# EAGLE board csa_bios_v3.0g (EAGLE 6.4)
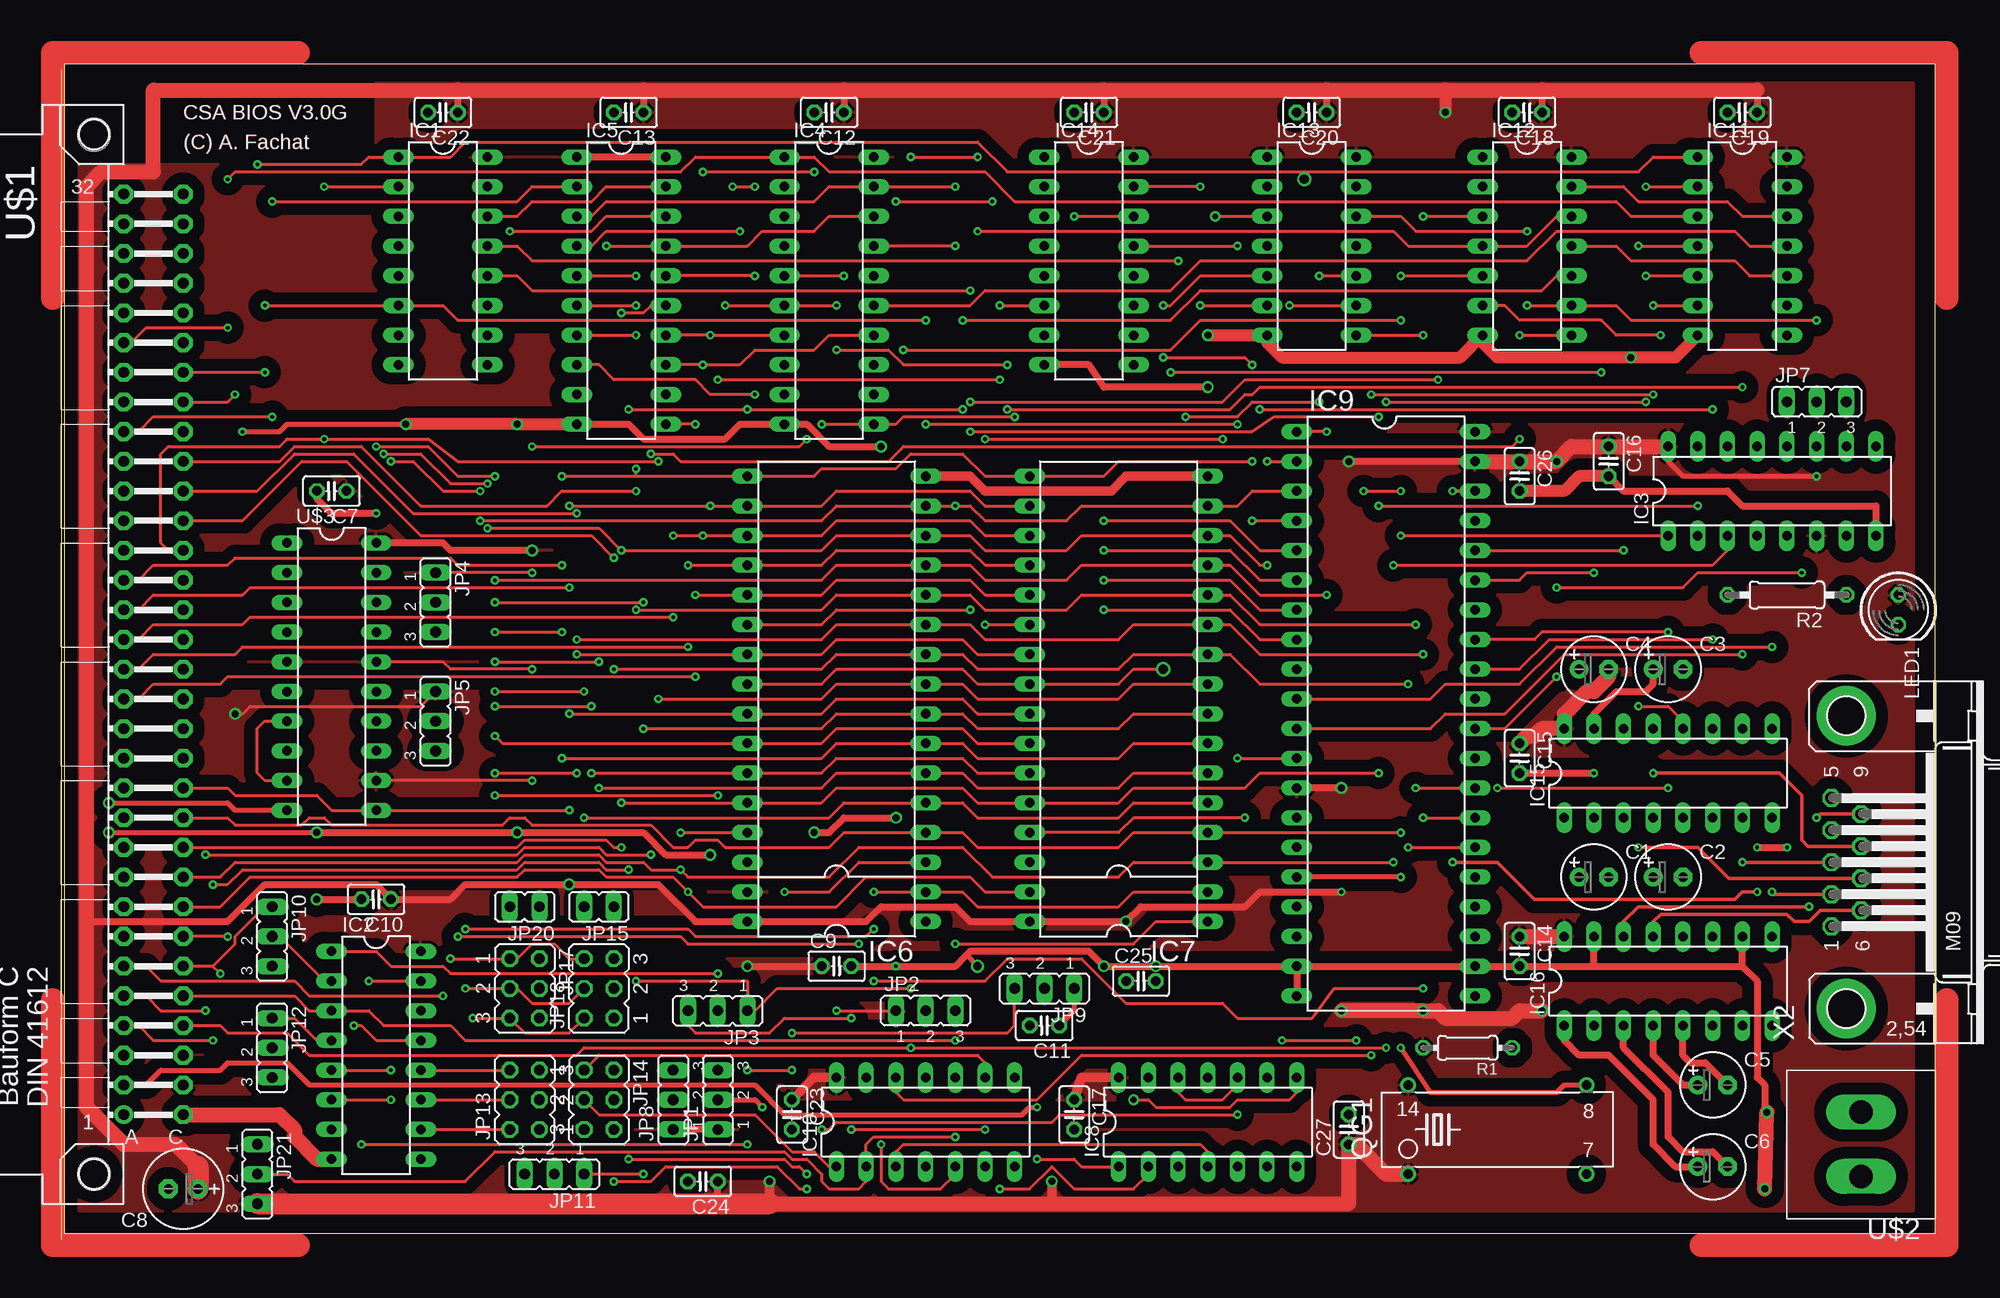
[diagram p2: board, top side]
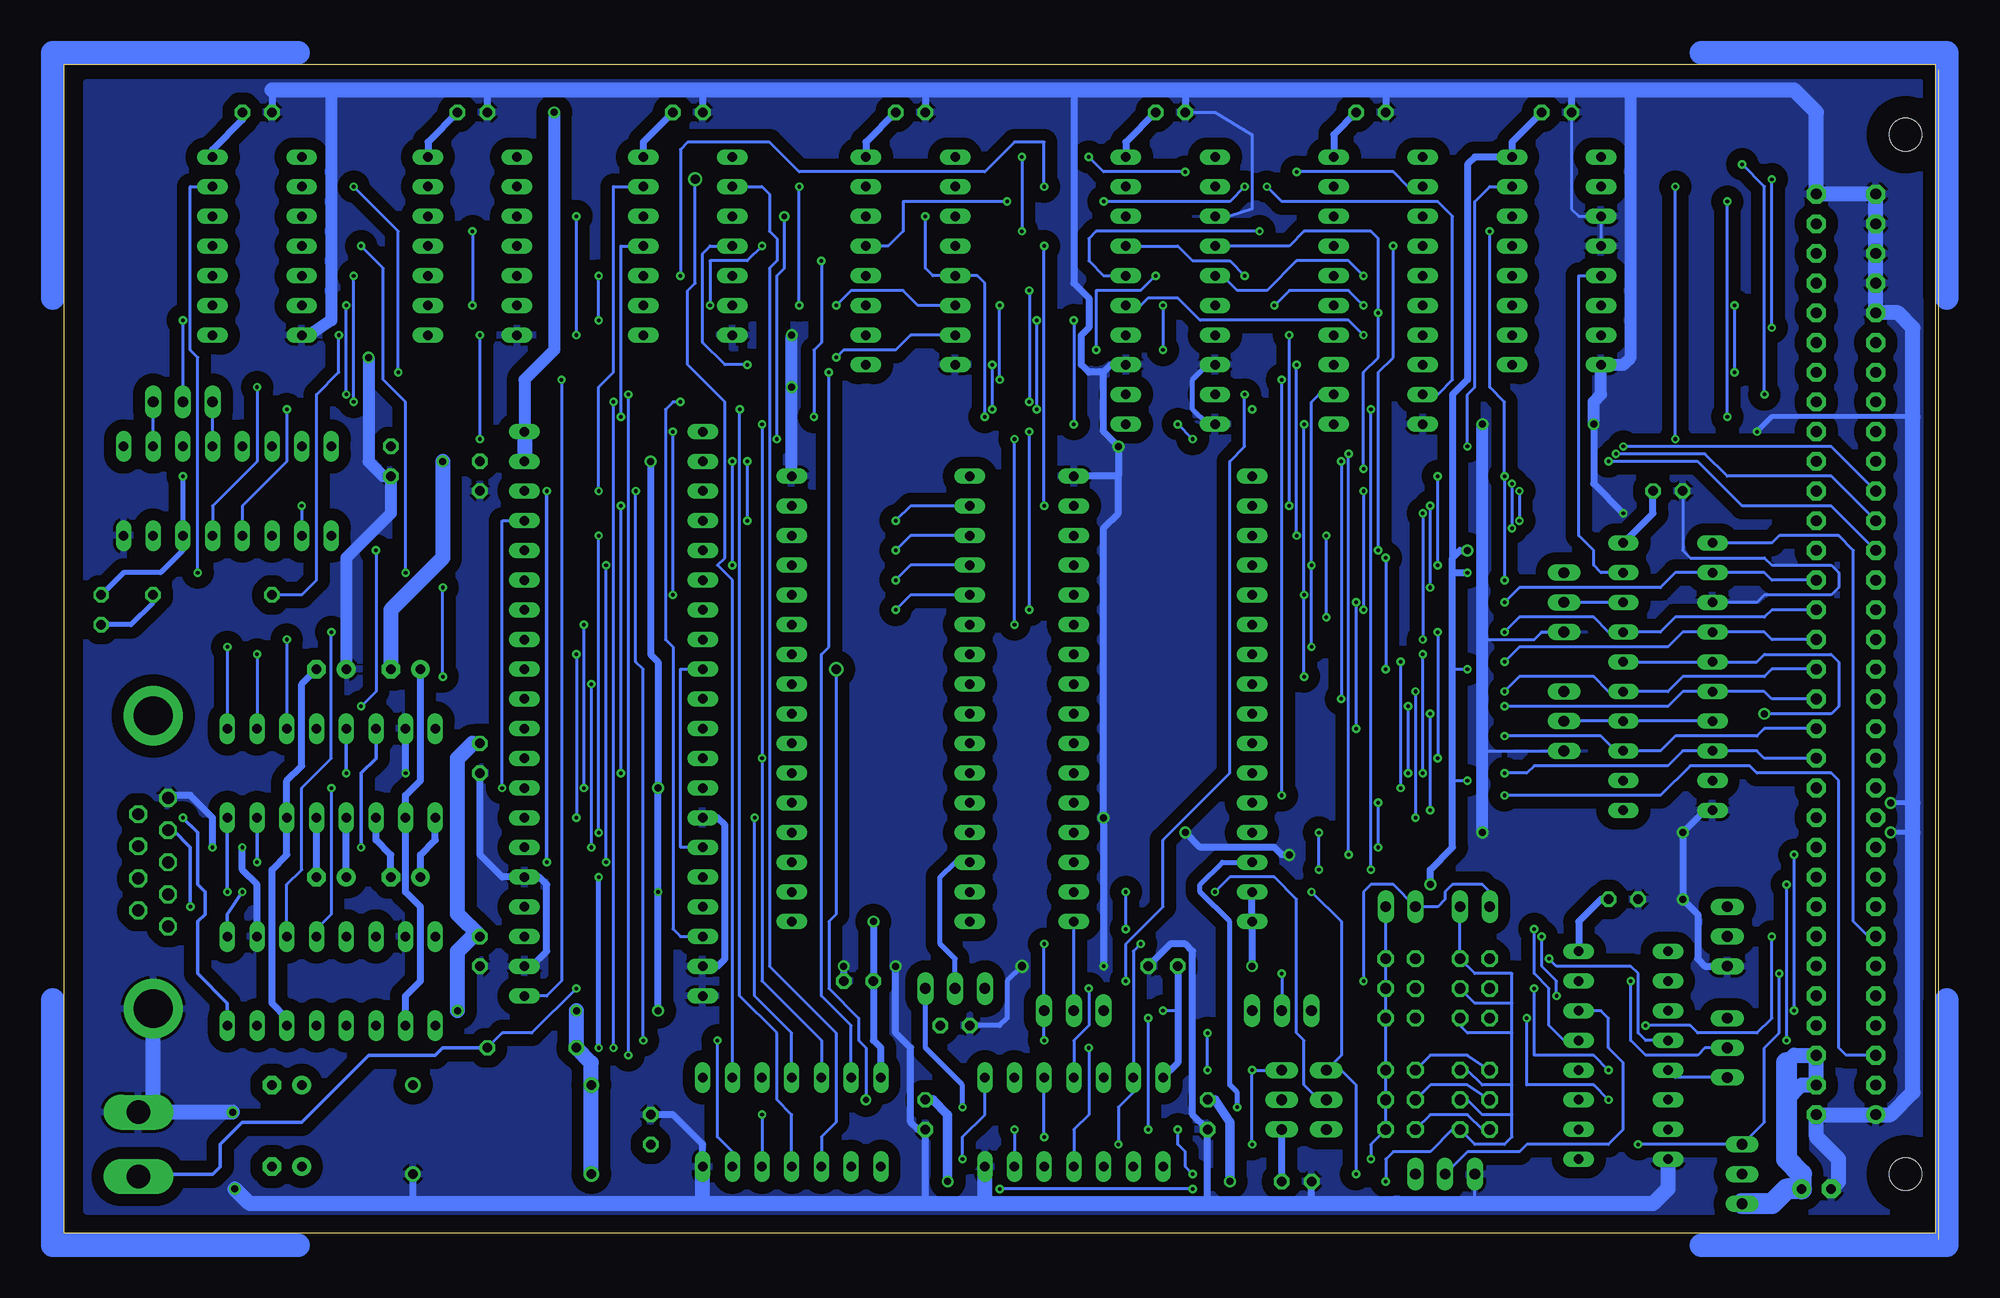
[diagram p3: board, bottom side, seen from below]

Size 160 x 100 mm. Coordinates in mm from the lower left corner, seen from the top.
Outline: 0,0 160,0 160,100 0,100 0,0
Copper layers (1*16): Top 0.035mm / dielectric 1.5mm / Bottom 0.035mm
Design rules "default *": minimum track width 10mil, minimum drill 12mil, track to track 6mil, track to pad 6mil, pad to pad 6mil, via to via 6mil, smd to smd 6mil, copper to edge 40mil, drill to drill 6mil, minimum pad ring 10mil, minimum via ring 8mil, stop-mask expansion 4mil, vias tented up to drill 0mil, thermal gap 10mil

## Footprints (pad centres in the part's own frame; a part is rotated, then mirrored left to right if it is on the bottom)
E2,5-6 = drill 0.813 pad 1.6: + -1.27,0 | drill 0.813 pad 1.6 octagon: - 1.27,0
C025-025X050 = drill 0.813 octagon: 1 -1.27,0; 2 1.27,0
E2,5-7 = drill 0.813 pad 1.6: + -1.27,0 | drill 0.813 pad 1.6 octagon: - 1.27,0
DIL16 = drill 0.813 long: 1 -8.89,-3.81; 2 -6.35,-3.81; 3 -3.81,-3.81; 4 -1.27,-3.81; 5 1.27,-3.81; 6 3.81,-3.81; 7 6.35,-3.81; 8 8.89,-3.81; 9 8.89,3.81; 10 6.35,3.81; 11 3.81,3.81; 12 1.27,3.81; 13 -1.27,3.81; 14 -3.81,3.81; 15 -6.35,3.81; 16 -8.89,3.81
DIL20 = drill 0.813 long: 1 -10.16,-3.81; 2 -7.62,-3.81; 3 -5.08,-3.81; 4 -2.54,-3.81; 5 0,-3.81; 6 2.54,-3.81; 7 5.08,-3.81; 8 7.62,-3.81; 9 10.16,-3.81; 10 12.7,-3.81; 11 12.7,3.81; 12 10.16,3.81; 13 7.62,3.81; 14 5.08,3.81; 15 2.54,3.81; 16 0,3.81; 17 -2.54,3.81; 18 -5.08,3.81; 19 -7.62,3.81; 20 -10.16,3.81
DIL20' = drill 0.813 long: 1 -11.43,-3.81; 2 -8.89,-3.81; 3 -6.35,-3.81; 4 -3.81,-3.81; 5 -1.27,-3.81; 6 1.27,-3.81; 7 3.81,-3.81; 8 6.35,-3.81; 9 8.89,-3.81; 10 11.43,-3.81; 11 11.43,3.81; 12 8.89,3.81; 13 6.35,3.81; 14 3.81,3.81; 15 1.27,3.81; 16 -1.27,3.81; 17 -3.81,3.81; 18 -6.35,3.81; 19 -8.89,3.81; 20 -11.43,3.81
DIL32OPT28 = drill 0.813 long: 1 -19.05,-7.62; 2 -16.51,-7.62; 3 -13.97,-7.62; 4 -11.43,-7.62; 5 -8.89,-7.62; 6 -6.35,-7.62; 7 -3.81,-7.62; 8 -1.27,-7.62; 9 1.27,-7.62; 10 3.81,-7.62; 11 6.35,-7.62; 12 8.89,-7.62; 13 11.43,-7.62; 14 13.97,-7.62; 15 16.51,-7.62; 16 19.05,-7.62; 17 19.05,7.62; 18 16.51,7.62; 19 13.97,7.62; 20 11.43,7.62; 21 8.89,7.62; 22 6.35,7.62; 23 3.81,7.62; 24 1.27,7.62; 25 -1.27,7.62; 26 -3.81,7.62; 27 -6.35,7.62; 28 -8.89,7.62; 29 -11.43,7.62; 30 -13.97,7.62; 31 -16.51,7.62; 32 -19.05,7.62
DIL14 = drill 0.813 long: 1 -7.62,-3.81; 2 -5.08,-3.81; 3 -2.54,-3.81; 4 0,-3.81; 5 2.54,-3.81; 6 5.08,-3.81; 7 7.62,-3.81; 8 7.62,3.81; 9 5.08,3.81; 10 2.54,3.81; 11 0,3.81; 12 -2.54,3.81; 13 -5.08,3.81; 14 -7.62,3.81
DIL40 = drill 0.813 long: 1 -16.51,-7.62; 2 -13.97,-7.62; 3 -11.43,-7.62; 4 -8.89,-7.62; 5 -6.35,-7.62; 6 -3.81,-7.62; 7 -1.27,-7.62; 8 1.27,-7.62; 9 3.81,-7.62; 10 6.35,-7.62; 11 8.89,-7.62; 12 11.43,-7.62; 13 13.97,-7.62; 14 16.51,-7.62; 15 19.05,-7.62; 16 21.59,-7.62; 17 24.13,-7.62; 18 26.67,-7.62; 19 29.21,-7.62; 20 31.75,-7.62; 21 31.75,7.62; 22 29.21,7.62; 23 26.67,7.62; 24 24.13,7.62; 25 21.59,7.62; 26 19.05,7.62; 27 16.51,7.62; 28 13.97,7.62; 29 11.43,7.62; 30 8.89,7.62; 31 6.35,7.62; 32 3.81,7.62; 33 1.27,7.62; 34 -1.27,7.62; 35 -3.81,7.62; 36 -6.35,7.62; 37 -8.89,7.62; 38 -11.43,7.62; 39 -13.97,7.62; 40 -16.51,7.62
JP2 = drill 0.914 long: 1 -2.54,0; 2 0,0; 3 2.54,0
JP3Q = drill 0.914 octagon: 1 -2.54,-1.27; 2 -2.54,1.27; 3 0,-1.27; 4 0,1.27; 5 2.54,-1.27; 6 2.54,1.27
JP1 = drill 0.914 long: 1 0,-1.27; 2 0,1.27
LED5MM = drill 0.813 octagon: A -1.27,0; K 1.27,0
SG51 = drill 0.813: 1 -7.62,-3.81; 7 7.62,-3.81; 8 7.62,3.81; 14 -7.62,3.81
0204/7 = drill 0.813 octagon: 1 -3.81,0; 2 3.81,0
0207/10 = drill 0.813 octagon: 1 -5.08,0; 2 5.08,0
CSABUS = drill 0.914 pad 1.6: A1 7.62,36.83 | drill 0.914 pad 1.6 octagon: A2 7.62,34.29; A3 7.62,31.75; A4 7.62,29.21; A5 7.62,26.67; A6 7.62,24.13; A7 7.62,21.59; A8 7.62,19.05; A9 7.62,16.51; A10 7.62,13.97; A11 7.62,11.43; A12 7.62,8.89; A13 7.62,6.35; A14 7.62,3.81; A15 7.62,1.27; A16 7.62,-1.27; A17 7.62,-3.81; A18 7.62,-6.35; A19 7.62,-8.89; A20 7.62,-11.43; A21 7.62,-13.97; A22 7.62,-16.51; A23 7.62,-19.05; A24 7.62,-21.59; A25 7.62,-24.13; A26 7.62,-26.67; A27 7.62,-29.21; A28 7.62,-31.75; A29 7.62,-34.29; A30 7.62,-36.83; A31 7.62,-39.37; A32 7.62,-41.91; C1 2.54,36.83; C2 2.54,34.29; C3 2.54,31.75; C4 2.54,29.21; C5 2.54,26.67; C6 2.54,24.13; C7 2.54,21.59; C8 2.54,19.05; C9 2.54,16.51; C10 2.54,13.97; C11 2.54,11.43; C12 2.54,8.89; C13 2.54,6.35; C14 2.54,3.81; C15 2.54,1.27; C16 2.54,-1.27; C17 2.54,-3.81; C18 2.54,-6.35; C19 2.54,-8.89; C20 2.54,-11.43; C21 2.54,-13.97; C22 2.54,-16.51; C23 2.54,-19.05; C24 2.54,-21.59; C25 2.54,-24.13; C26 2.54,-26.67; C27 2.54,-29.21; C28 2.54,-31.75; C29 2.54,-34.29; C30 2.54,-36.83; C31 2.54,-39.37; C32 2.54,-41.91 | hole 2.794: 10.16,41.91; 10.16,-46.99
TASTER = drill 2.007 long: 1 0,4.013; 3 0,-1.473
M09HP = drill 1.016 octagon: 1 -5.486,1.27; 2 -2.743,1.27; 3 0,1.27; 4 2.743,1.27; 5 5.486,1.27; 6 -4.115,-1.27; 7 -1.372,-1.27; 8 1.372,-1.27; 9 4.115,-1.27 | drill 3.302 pad 5.08: G1 -12.522,0; G2 12.522,0

## Placement (x,y rotation side)
C1  1u  [E2,5-6]  130.81,30.48 0 top
C2  1u  [E2,5-6]  137.16,30.48 0 top
C3  4u7  [E2,5-6]  137.16,48.26 0 top
C4  4u7  [E2,5-6]  130.81,48.26 0 top
C5  1u  [E2,5-6]  140.97,12.7 0 top
C6  1u  [E2,5-6]  140.97,5.71 0 top
C7  100n  [C025-025X050]  22.86,63.5 180 top
C8  47u  [E2,5-7]  10.16,3.81 180 top
C9  100n  [C025-025X050]  66.04,22.86 0 top
C10  100n  [C025-025X050]  26.67,28.57 180 top
C11  100n  [C025-025X050]  83.82,17.78 180 top
C12  100n  [C025-025X050]  65.41,95.89 180 top
C13  100n  [C025-025X050]  48.26,95.89 180 top
C14  100n  [C025-025X050]  124.46,24.13 270 top
C15  100n  [C025-025X050]  124.46,40.64 270 top
C16  100n  [C025-025X050]  132.08,66.04 270 top
C17  100n  [C025-025X050]  86.36,10.16 270 top
C18  100n  [C025-025X050]  125.09,95.89 180 top
C19  100n  [C025-025X050]  143.51,95.89 180 top
C20  100n  [C025-025X050]  106.68,95.89 180 top
C21  100n  [C025-025X050]  87.63,95.89 180 top
C22  100n  [C025-025X050]  32.38,95.89 180 top
C23  100n  [C025-025X050]  62.23,10.16 270 top
C24  100n  [C025-025X050]  54.61,4.45 180 top
C25  100n  [C025-025X050]  92.08,21.59 0 top
C26  100n  [C025-025X050]  124.46,64.77 270 top
C27  100n  [C025-025X050]  109.86,8.89 90 top
IC1  74HC138N  [DIL16]  32.38,83.19 270 top
IC2  74LS139N  [DIL16]  26.67,15.24 270 top
IC3  74HC138N  [DIL16]  146.05,63.5 0 top
IC4  74LS273BUSOPT  [DIL20]  65.41,81.92 270 top
IC5  74HCT245N  [DIL20']  47.62,80.64 270 top
IC6  ROMSOCK32TO512K  [DIL32OPT28]  66.04,45.72 90 top
IC7  RAMSOCK32TO512K  [DIL32OPT28]  90.17,45.72 90 top
IC8  74HCT00N  [DIL14]  97.79,9.53 0 top
IC9  UART  [DIL40]  113.03,52.07 270 top
IC10  74LS32N  [DIL14]  73.66,9.53 0 top
IC11  74LS04N  [DIL14]  143.51,84.45 270 top
IC12  74LS07N  [DIL14]  125.09,84.45 270 top
IC13  74HCT00N  [DIL14]  106.68,84.45 270 top
IC14  74LS279N  [DIL16]  87.63,83.19 270 top
IC15  MAX232  [DIL16]  137.16,39.37 0 top
IC16  MAX232  [DIL16]  137.16,21.59 0 top
JP1  [JP2]  55.88,11.43 90 top
JP2  [JP2]  73.66,19.05 0 top
JP3  [JP2]  55.88,19.05 180 top
JP4  [JP2]  31.75,53.98 270 top
JP5  [JP2]  31.75,43.81 270 top
JP7  [JP2]  149.86,71.12 0 top
JP8  [JP2]  52.07,11.43 90 top
JP9  [JP2]  83.82,20.95 180 top
JP10  [JP2]  17.78,25.4 270 top
JP11  [JP2]  41.91,5.08 180 top
JP12  [JP2]  17.78,15.88 270 top
JP13  [JP3Q]  39.37,11.43 90 top
JP14  [JP3Q]  45.72,11.43 270 top
JP15  [JP1]  45.72,27.94 90 top
JP17  [JP3Q]  39.37,20.95 270 top
JP18  [JP3Q]  45.72,20.95 90 top
JP20  [JP1]  39.37,27.94 90 top
JP21  [JP2]  16.51,5.08 270 top
LED1  [LED5MM]  156.84,53.34 270 top
QG1  1,8432MHz  [SG51]  122.56,8.89 0 top
R1  4k7  [0204/7]  120.02,15.88 180 top
R2  220  [0207/10]  147.32,54.61 180 top
U$1  CSABUS  [CSABUS]  12.7,46.99 180 top
U$2  TASTER  [TASTER]  153.67,8.89 180 top
U$3  74LS688BUSOPT  [DIL20]  22.86,48.9 270 top
X2  [M09HP]  152.4,31.75 90 top

## Tracks (layer width: path | path; a pad name or v marks a point on that pad's centre or on a via)
50HZ  (via drill 0.3)
  Top 0.254: v36.83,37.47 v55.88,37.47 | v55.88,73.03 v80.01,73.03 | v80.01,79.38 IC14.6 | v93.98,79.38 94.61,79.38 97.16,81.92 IC13.5
  Bottom 0.254: U$1.A3 7.62,15.24 8.26,15.88 8.26,38.73 8.89,39.37 15.24,39.37 15.88,40.01 20.95,40.01 23.5,37.47 v36.83,37.47 | v55.88,37.47 v55.88,73.03 | v80.01,73.03 v80.01,79.38 | IC14.6 87,79.38 88.27,80.64 92.71,80.64 v93.98,79.38
/CTRLR
  Top 0.254: IC1.14 38.73,87 40.01,88.27 45.09,88.27 46.35,89.53 IC5.19
/CTRLW  (via drill 0.3)
  Top 0.254: v40.01,67.31 62.87,67.31 v63.5,67.94 | v64.77,69.22 IC4.11 71.12,69.22 71.75,69.85 v81.28,69.85 | v86.36,87 IC14.14
  Bottom 0.254: IC1.15 38.1,89.53 39.37,88.27 39.37,72.39 40.01,71.75 v40.01,67.31 | v63.5,67.94 v64.77,69.22 | v81.28,69.85 81.28,81.28 81.92,81.92 IC14.5 85.72,81.92 86.36,82.55 v86.36,87
/EXTIO  (via drill 0.3)
  Top 0.254: U$1.A5 6.99,20.32 8.26,19.05 v12.06,19.05 | v12.06,32.38 38.73,32.38 39.37,33.02 45.72,33.02 46.35,32.38 v50.16,32.38 | v50.16,66.67 52.07,66.67 52.7,66.04 70.48,66.04 71.75,67.31 123.83,67.31 v124.46,67.94 | v124.46,76.83 IC12.8
  Bottom 0.254: v12.06,19.05 v12.06,32.38 | v50.16,32.38 v50.16,66.67 | v124.46,67.94 v124.46,76.83
/EXTIOEN  (via drill 0.3)
  Top 0.254: IC5.6 v48.9,79.38 | v56.52,79.38 IC4.6 v66.04,79.38 | v66.04,75.56 70.48,75.56 71.75,74.3 v80.64,74.3 | v80.64,70.48 99.69,70.48 100.97,71.75 101.6,71.75 102.23,72.39 v143.51,72.39
  Bottom 0.254: IC3.5 147.32,62.23 143.51,66.04 v143.51,72.39 | v48.9,79.38 50.16,80.64 55.24,80.64 v56.52,79.38 | v66.04,79.38 v66.04,75.56 | v80.64,74.3 v80.64,70.48
/IOINH  (via drill 0.3)
  Top 0.254: U$1.A4 6.35,17.78 7.62,16.51 v12.7,16.51 | v12.7,29.84 13.97,29.84 15.24,31.11 38.73,31.11 39.37,31.75 45.72,31.75 46.35,31.11 v48.26,31.11 | v48.26,70.48 v58.42,70.48 v76.83,70.48 | IC12.10 127.64,81.92 126.36,80.64 97.16,80.64 94.61,78.11 v76.83,78.11
  Bottom 0.254: v12.7,16.51 v12.7,29.84 | v48.26,31.11 v48.26,70.48 | v76.83,70.48 v76.83,78.11
/IOSEL
  Bottom 0.254: U$1.A7 5.71,25.4 6.99,26.67 6.99,58.42 8.26,59.69 13.34,59.69 13.97,59.05 U$3.1
/IRQ  (via drill 0.3)
  Top 0.254: IC12.12 127.64,87 125.09,84.45 IC12.4 114.94,84.45 113.67,85.72 v78.11,85.72 | U$1.A24 6.35,68.58 7.62,69.85 v17.78,69.85 | v17.78,88.27 38.73,88.27 40.01,89.53 IC5.2 | v54.61,90.81 v64.14,90.81 | v72.39,92.08 v78.11,92.08
  Bottom 0.254: v17.78,69.85 v17.78,88.27 | IC5.2 45.09,89.53 46.35,90.81 v54.61,90.81 | v64.14,90.81 71.12,90.81 v72.39,92.08 | v78.11,92.08 v78.11,85.72
/MEMSEL  (via drill 0.3)
  Top 0.254: U$1.A6 6.99,22.86 8.26,21.59 19.68,21.59 20.95,20.32 v32.38,20.32 | v33.66,25.4 52.7,25.4 53.34,24.77 v67.94,24.77 | v69.85,7.62 69.85,4.45 70.48,3.81 74.93,3.81 76.2,5.08 IC10.5
  Bottom 0.254: v32.38,20.32 32.38,21.59 33.66,22.86 v33.66,25.4 | v67.94,24.77 68.58,24.13 IC10.13 68.58,12.06 69.85,10.79 v69.85,7.62
/OE  (via drill 0.5, 0.8)
  Top 0.254: IC6.24 64.77,46.99 66.04,48.26 76.83,48.26 78.11,46.99 IC7.24 90.17,46.99 91.44,48.26 v93.98,48.26 | v91.44,11.43 92.71,11.43 93.34,10.79 99.69,10.79 100.33,11.43 104.78,11.43 105.41,12.06 IC8.8
  Bottom 0.254: v93.98,48.26 93.98,27.3 94.61,26.67 94.61,20.95 92.08,18.41 92.08,16.51 91.44,15.88 v91.44,11.43
/RAM  (via drill 0.3)
  Top 0.254: v46.99,4.45 50.16,4.45 51.44,5.71 60.96,5.71 62.87,3.81 v63.5,3.81 | v80.01,3.81 82.55,3.81 84.45,5.71 86.36,3.81 91.44,3.81 92.71,5.08 IC8.2
  Bottom 0.254: 36.2,10.16 36.2,8.26 36.83,7.62 39.37,7.62 JP13.1 41.27,8.89 43.18,6.99 46.35,6.99 46.99,6.35 v46.99,4.45 | 36.2,10.16 38.73,10.16 40.01,11.43 JP13.3 | JP13.5 40.01,13.97 38.73,12.7 36.2,12.7 | 36.2,10.16 36.2,12.7 | JP17.6 40.64,17.78 40.01,17.14 36.2,17.14 | 36.2,12.7 36.2,17.14 | JP17.4 39.37,19.68 36.2,19.68 | 36.2,17.14 36.2,19.68 | 36.2,19.68 36.2,22.23 39.37,22.23 JP17.2 JP20.1 | v63.5,3.81 v80.01,3.81
/RAMSEL  (via drill 0.3)
  Top 0.254: IC6.22 64.77,52.07 66.04,53.34 v77.47,53.34 | v77.47,68.58 101.6,68.58 103.5,69.85 v112.39,69.85
  Bottom 0.254: v77.47,53.34 v77.47,68.58 | v112.39,69.85 112.39,84.45 IC13.11
/RES  (via drill 0.3)
  Top 0.254: IC11.3 133.99,87 132.72,88.27 81.28,88.27 78.74,90.81 65.41,90.81 64.14,92.08 IC4.1 53.98,92.08 52.7,90.81 14.61,90.81 v13.97,90.17 | U$1.A27 5.71,76.2 6.99,77.47 v13.97,77.47
  Bottom 0.254: v13.97,77.47 v13.97,90.17
/ROM  (via drill 0.3)
  Top 0.254: v48.26,6.35 61.59,6.35 62.23,5.71 62.87,5.71 v63.5,5.08 | v64.77,8.89 65.41,8.89 66.04,9.53 84.45,9.53 85.09,10.16 v100.33,10.16
  Bottom 0.254: JP15.1 JP18.5 JP18.3 JP18.1 JP14.2 JP14.4 JP14.6 48.26,7.62 v48.26,6.35 | v63.5,5.08 64.14,5.71 64.14,6.99 64.77,7.62 v64.77,8.89 | v100.33,10.16 IC8.5
/ROMCS  (via drill 0.3, 0.5)
  Top 0.254: v78.74,52.07 IC7.22 | v78.74,67.94 v99.06,67.94 | v98.42,87 IC13.3
  Bottom 0.254: v78.74,52.07 v78.74,67.94 | v99.06,67.94 99.06,81.92 98.42,82.55 v98.42,87
/UARTRD  (via drill 0.3)
  Top 0.254: IC1.12 38.73,81.92 40.01,80.64 v77.47,80.64 | v117.47,73.03 100.97,73.03 99.06,71.12 v77.47,71.12
  Bottom 0.254: IC9.21 118.75,20.32 117.47,21.59 v117.47,73.03 | v77.47,80.64 v77.47,71.12
/UARTWR  (via drill 0.3)
  Top 0.254: IC1.13 38.73,84.45 40.01,83.19 v95.25,83.19 | v95.89,69.85 100.33,69.85 101.6,71.12 v107.31,71.12
  Bottom 0.254: IC9.18 107.31,25.4 107.95,26.04 107.95,50.16 108.58,50.8 108.58,70.48 107.95,71.12 v107.31,71.12 | v95.25,83.19 95.25,76.2 95.89,75.56 v95.89,69.85
BUSA0  (via drill 0.3)
  Top 0.254: U$1.C23 18.41,66.04 19.68,67.31 25.4,67.31 30.48,62.23 41.27,62.23 42.55,63.5 v48.9,63.5 | v48.9,53.34 64.77,53.34 66.04,54.61 IC6.12 77.47,54.61 78.74,53.34 85.72,53.34 87,54.61 IC7.12 99.69,54.61 102.23,52.07 v115.57,52.07 | v115.57,38.1 IC9.28
  Bottom 0.254: v48.9,63.5 v48.9,53.34 | v115.57,52.07 v115.57,38.1
BUSA1  (via drill 0.3)
  Top 0.254: U$1.C22 16.51,63.5 19.68,66.67 24.77,66.67 29.84,61.59 v43.81,61.59 | v43.81,50.8 64.77,50.8 66.04,52.07 IC6.11 77.47,52.07 78.74,50.8 90.17,50.8 91.44,52.07 IC7.11 99.69,52.07 102.23,49.53 v116.2,49.53 | v116.2,35.56 IC9.27
  Bottom 0.254: v43.81,61.59 v43.81,50.8 | v116.2,49.53 v116.2,35.56
BUSA2  (via drill 0.3)
  Top 0.254: U$1.C21 15.24,60.96 20.32,66.04 24.13,66.04 30.48,59.69 45.09,59.69 v46.99,57.78 | v46.99,48.26 64.77,48.26 66.04,49.53 IC6.10 76.83,49.53 78.11,48.26 90.17,48.26 91.44,49.53 IC7.10 99.69,49.53 102.23,46.99 v114.94,46.99 | v114.94,33.02 IC9.26
  Bottom 0.254: v46.99,57.78 v46.99,48.26 | v114.94,46.99 v114.94,33.02
BUSA3  (via drill 0.3)
  Top 0.254: U$1.C20 8.89,58.42 8.26,59.05 8.26,66.67 8.89,67.31 18.41,67.31 19.05,67.94 v22.23,67.94 31.11,67.94 33.66,66.04 v50.8,66.04 | v22.23,89.53 IC1.2 | IC7.9 91.44,46.99 90.17,45.72 78.11,45.72 76.83,46.99 IC6.9 66.04,46.99 64.77,45.72 v50.8,45.72
  Bottom 0.254: v22.23,67.94 v22.23,89.53 | v50.8,66.04 v50.8,45.72
BUSA4  (via drill 0.3)
  Top 0.254: v36.83,53.98 v49.53,53.98 | v49.53,43.18 64.77,43.18 66.04,44.45 IC6.8 76.83,44.45 78.11,43.18 90.17,43.18 91.44,44.45 IC7.8
  Bottom 0.254: U$1.C19 13.97,55.88 14.61,56.52 U$3.2 22.23,56.52 23.5,55.24 35.56,55.24 v36.83,53.98 | v49.53,53.98 v49.53,43.18
BUSA5  (via drill 0.3)
  Top 0.254: v36.83,51.44 v42.55,51.44 | v42.55,40.64 64.77,40.64 66.04,41.91 IC6.7 76.83,41.91 78.11,40.64 90.17,40.64 91.44,41.91 IC7.7
  Bottom 0.254: U$1.C18 13.97,53.34 14.61,52.7 22.23,52.7 23.5,51.44 U$3.17 27.94,51.44 29.21,52.7 35.56,52.7 v36.83,51.44 | v42.55,51.44 v42.55,40.64
BUSA6  (via drill 0.3)
  Top 0.254: v36.83,48.9 v45.72,48.9 | v45.72,38.1 64.77,38.1 66.04,39.37 IC6.6 76.83,39.37 78.11,38.1 90.17,38.1 91.44,39.37 IC7.6
  Bottom 0.254: U$1.C17 13.97,50.8 14.61,51.44 U$3.4 21.59,51.44 22.86,50.16 35.56,50.16 v36.83,48.9 | v45.72,48.9 v45.72,38.1
BUSA7  (via drill 0.3)
  Top 0.254: v36.83,46.35 v44.45,46.35 | v44.45,35.56 65.41,35.56 66.67,36.83 IC6.5 76.83,36.83 78.11,35.56 90.17,35.56 91.44,36.83 IC7.5
  Bottom 0.254: U$1.C16 13.97,48.26 14.61,47.62 21.59,47.62 22.86,46.35 U$3.15 27.94,46.35 29.21,47.62 35.56,47.62 v36.83,46.35 | v44.45,46.35 v44.45,35.56
BUSA8  (via drill 0.3)
  Top 0.254: v36.83,45.09 v45.09,45.09 | v45.09,39.37 IC6.27 64.77,39.37 66.04,40.64 76.83,40.64 78.11,39.37 IC7.27
  Bottom 0.254: U$1.C15 13.97,45.72 14.61,46.35 U$3.6 21.59,46.35 22.86,45.09 v36.83,45.09 | v45.09,45.09 v45.09,39.37
BUSA9  (via drill 0.3)
  Top 0.254: v36.83,42.55 37.47,41.91 IC6.26 64.77,41.91 66.04,43.18 76.83,43.18 78.11,41.91 IC7.26
  Bottom 0.254: U$1.C14 14.61,43.18 15.24,42.55 22.23,42.55 23.5,41.27 U$3.13 27.3,41.27 28.57,42.55 v36.83,42.55
BUSA10  (via drill 0.3)
  Top 0.254: v43.81,49.53 IC6.23 64.77,49.53 66.04,50.8 76.83,50.8 78.11,49.53 IC7.23 | v36.83,39.37 v43.81,39.37
  Bottom 0.254: U$1.C13 14.61,40.64 15.24,41.27 U$3.8 21.59,41.27 22.86,40.01 34.29,40.01 34.92,39.37 v36.83,39.37 | v43.81,39.37 v43.81,49.53
BUSA11  (via drill 0.3)
  Top 0.254: v43.18,44.45 IC6.25 64.77,44.45 66.04,45.72 76.83,45.72 78.11,44.45 IC7.25 | v43.18,36.2 U$3.11 22.86,36.2 21.59,37.47 14.61,37.47 13.97,38.1 U$1.C12
  Bottom 0.254: v43.18,36.2 v43.18,44.45
BUSA12  (via drill 0.3)
  Top 0.254: U$1.C11 13.97,35.56 14.61,34.92 20.32,34.92 20.95,35.56 22.23,35.56 22.86,34.92 37.47,34.92 38.1,35.56 39.37,35.56 40.01,34.92 50.16,34.92 52.07,33.02 53.34,33.02 53.98,33.66 55.88,33.66 56.52,33.02 65.41,33.02 66.67,34.29 IC6.4 76.83,34.29 78.11,33.02 90.17,33.02 91.44,34.29 IC7.4 v114.3,34.29 | v114.3,59.69 IC3.1
  Bottom 0.254: v114.3,34.29 v114.3,59.69
BUSA13  (via drill 0.3)
  Top 0.254: U$1.C10 38.73,33.02 39.37,33.66 46.35,33.66 46.99,33.02 v47.62,33.02 | v47.62,36.83 IC6.28 64.77,36.83 66.04,38.1 76.83,38.1 78.11,36.83 IC7.28 90.17,36.83 91.44,38.1 100.97,38.1 102.23,39.37 v112.39,39.37 | v112.39,62.23 v139.7,62.23
  Bottom 0.254: v47.62,33.02 v47.62,36.83 | v112.39,39.37 v112.39,62.23 | v139.7,62.23 IC3.2
BUSA14  (via drill 0.3)
  Top 0.254: U$1.C9 13.34,30.48 14.61,31.75 38.73,31.75 39.37,32.38 45.72,32.38 46.35,31.75 49.53,31.75 50.16,31.11 v52.7,31.11 53.34,30.48 65.41,30.48 67.94,33.02 76.83,33.02 79.38,30.48 90.17,30.48 91.44,31.75 IC7.3 v113.67,31.75 | v52.7,34.29 IC6.29 | v113.67,57.15 140.97,57.15 142.24,58.42 IC3.3
  Bottom 0.254: v52.7,31.11 v52.7,34.29 | v113.67,31.75 v113.67,57.15
BUSA15  (via drill 0.3)
  Top 0.254: U$1.C8 13.34,27.94 15.88,30.48 38.73,30.48 39.37,31.11 45.72,31.11 46.35,30.48 52.07,30.48 v53.34,29.21 54.61,27.94 66.04,27.94 68.58,30.48 77.47,30.48 78.74,29.21 IC7.31 | v49.53,5.08 JP11.1
  Bottom 0.254: v49.53,5.08 49.53,12.7 50.8,13.97 JP8.3 50.8,15.24 50.8,26.67 v53.34,29.21
BUSA16  (via drill 0.3)
  Top 0.254: IC7.2 91.44,29.21 90.17,27.94 78.11,27.94 76.83,29.21 IC6.2 v69.22,29.21 | v13.97,25.4 U$1.C7 | v24.77,17.78 25.4,17.78 26.67,16.51 IC2.13 | v34.29,26.04 53.34,26.04 53.98,25.4 68.58,25.4 v69.22,26.04
  Bottom 0.254: v13.97,25.4 13.97,18.41 15.24,17.14 20.32,17.14 20.95,17.78 v24.77,17.78 | IC2.13 31.75,16.51 33.02,17.78 33.02,20.95 34.29,22.23 v34.29,26.04 | v69.22,26.04 v69.22,29.21
BUSA17  (via drill 0.3)
  Top 0.254: 12.7,22.86 U$1.C6 | 12.7,22.86 14.61,24.77 14.61,25.4 17.14,27.94 JP10.1 | v13.34,22.23 12.7,22.86 | v25.4,7.62 v58.42,7.62 | v58.42,13.97 v62.23,13.97 | v62.23,17.14 80.64,17.14 81.28,17.78 JP9.3
  Bottom 0.254: v13.34,22.23 13.34,17.14 14.61,15.88 14.61,9.53 JP21.1 v25.4,7.62 | v58.42,7.62 v58.42,13.97 JP1.3 | v62.23,13.97 v62.23,17.14
BUSA17X  (via drill 0.3)
  Top 0.254: JP21.2 19.05,5.08 19.68,4.45 34.29,4.45 36.83,6.99 61.59,6.99 62.23,6.35 63.5,6.35 64.77,5.08 64.77,4.45 65.41,3.81 67.94,3.81 68.58,4.45 IC10.2 68.58,7.62 69.22,8.26 v76.2,8.26
  Bottom 0.254: v76.2,8.26 IC10.10
BUSA18  (via drill 0.3)
  Top 0.254: U$1.C5 19.68,20.32 20.95,19.05 IC2.3 26.04,19.05 27.3,17.78 33.02,17.78 34.29,16.51 v76.2,16.51 | v76.2,24.77 91.44,24.77 93.34,26.67 IC7.1
  Bottom 0.254: v76.2,16.51 JP2.3 v76.2,24.77
BUSA19  (via drill 0.3)
  Top 0.254: U$1.C4 13.34,17.78 13.97,17.14 19.05,17.14 20.95,15.24 43.81,15.24 44.45,15.88 v72.39,15.88 v113.03,15.88 | v113.03,71.12 v135.25,71.12 | v135.25,81.92 IC11.5
  Bottom 0.254: v72.39,15.88 72.39,10.16 73.66,8.89 IC10.4 | v113.03,15.88 v113.03,71.12 | v135.25,71.12 v135.25,81.92
BUSD0  (via drill 0.3)
  Top 0.254: v26.67,67.31 31.11,67.31 33.66,64.77 v36.83,64.77 | v36.83,55.88 64.77,55.88 66.04,57.15 IC6.13 77.47,57.15 78.74,55.88 85.72,55.88 87,57.15 IC7.13 99.69,57.15 102.23,54.61 v107.95,54.61 | v107.95,68.58 IC9.1 | v38.1,85.72 45.09,85.72 46.35,87 IC5.18
  Bottom 0.254: U$1.A22 8.89,67.31 v26.67,67.31 | v36.83,55.88 v36.83,64.77 36.83,71.12 38.1,72.39 v38.1,85.72 | v107.95,54.61 v107.95,68.58
BUSD1  (via drill 0.3)
  Top 0.254: v27.3,66.67 30.48,66.67 33.02,64.14 v36.2,64.14 | v36.2,60.33 45.72,60.33 v47.62,58.42 64.77,58.42 66.04,59.69 IC6.14 77.47,59.69 78.74,58.42 85.72,58.42 87,59.69 IC7.14 99.69,59.69 102.23,57.15 v102.87,57.15 | v102.87,66.04 IC9.2 | IC4.18 65.41,87 64.14,85.72 59.69,85.72 58.42,84.45 IC5.17 v46.35,84.45
  Bottom 0.254: U$1.A21 8.89,64.77 17.78,64.77 19.68,66.67 v27.3,66.67 | v36.2,64.14 v36.2,60.33 | v102.87,57.15 v102.87,66.04 | v47.62,58.42 47.62,73.66 46.35,74.93 v46.35,84.45
BUSD2  (via drill 0.3)
  Top 0.254: v27.94,66.04 29.84,66.04 32.38,63.5 v35.56,63.5 | IC9.3 101.6,63.5 100.33,62.23 IC7.15 87,62.23 85.72,60.96 78.74,60.96 77.47,62.23 v76.2,62.23 IC6.15 66.04,62.23 64.77,60.96 v35.56,60.96 | v59.05,81.92 IC5.16 | v76.2,84.45 IC4.17
  Bottom 0.254: U$1.A20 8.89,62.23 16.51,62.23 20.32,66.04 v27.94,66.04 | v35.56,63.5 v35.56,60.96 | IC4.17 64.77,84.45 63.5,83.19 60.33,83.19 v59.05,81.92 | v76.2,62.23 v76.2,84.45
BUSD3  (via drill 0.3)
  Top 0.254: U$1.A19 6.35,55.88 7.62,57.15 13.97,57.15 14.61,57.78 33.02,57.78 33.66,57.15 v42.55,57.15 | v42.55,64.77 48.9,64.77 | 48.9,64.77 IC6.17 64.14,64.77 64.77,65.41 71.12,65.41 72.39,66.67 76.83,66.67 78.74,64.77 IC7.17 88.9,64.77 90.17,66.04 v101.6,66.04 | v101.6,60.96 IC9.4 | v47.62,78.74 49.53,78.74 50.16,79.38 IC5.15 | 48.9,64.77 v48.9,65.41
  Bottom 0.254: v42.55,57.15 v42.55,64.77 | v101.6,66.04 v101.6,60.96 | IC4.4 55.24,84.45 53.98,85.72 48.26,85.72 47.62,85.09 v47.62,78.74 47.62,74.93 48.9,73.66 v48.9,65.41
BUSD4  (via drill 0.3)
  Top 0.254: U$1.A18 6.35,53.34 7.62,54.61 15.24,54.61 15.88,55.24 v43.18,55.24 | v43.18,62.23 v55.24,62.23 IC6.18 64.77,62.23 66.04,63.5 77.47,63.5 78.74,62.23 IC7.18 | IC5.14 v55.24,76.83 IC4.7 | v88.9,60.96 99.69,60.96 102.23,58.42 IC9.5
  Bottom 0.254: v43.18,55.24 v43.18,62.23 | v55.24,62.23 v55.24,76.83 | IC7.18 87.63,62.23 v88.9,60.96
BUSD5  (via drill 0.3)
  Top 0.254: U$1.A17 6.35,50.8 7.62,52.07 15.24,52.07 15.88,52.7 v52.07,52.7 | v52.07,59.69 v54.61,59.69 IC6.19 64.77,59.69 66.04,60.96 77.47,60.96 78.74,59.69 IC7.19 | IC5.13 v54.61,74.3 57.78,74.3 59.05,75.56 64.14,75.56 65.41,76.83 IC4.14 | v88.9,58.42 99.69,58.42 102.23,55.88 IC9.6
  Bottom 0.254: v52.07,52.7 v52.07,59.69 | v54.61,59.69 v54.61,74.3 | IC7.19 87.63,59.69 v88.9,58.42
BUSD6  (via drill 0.3)
  Top 0.254: U$1.A16 6.35,48.26 7.62,49.53 14.61,49.53 15.24,50.16 v53.34,50.16 | v53.34,57.15 IC6.20 64.77,57.15 66.04,58.42 77.47,58.42 78.74,57.15 IC7.20 | v88.9,55.88 99.69,55.88 102.23,53.34 IC9.7
  Bottom 0.254: v53.34,50.16 v53.34,57.15 53.34,71.12 52.7,71.75 IC5.12 | IC7.20 87.63,57.15 v88.9,55.88
BUSD7  (via drill 0.3)
  Top 0.254: U$1.A15 6.35,45.72 7.62,46.99 13.34,46.99 13.97,47.62 v53.98,47.62 | v53.98,54.61 IC6.21 64.77,54.61 66.04,55.88 77.47,55.88 78.74,54.61 IC7.21 | v53.98,69.22 IC5.11 | v88.9,53.34 99.69,53.34 102.23,50.8 IC9.8
  Bottom 0.254: v53.98,47.62 v53.98,54.61 v53.98,69.22 | IC7.21 87.63,54.61 v88.9,53.34
CLKIRQ  (via drill 0.3)
  Top 0.254: v57.15,89.53 v59.05,89.53 | v71.12,88.27 v79.38,88.27 | IC14.13 v100.33,84.45 | v104.78,79.38 IC13.9
  Bottom 0.254: IC5.9 42.55,71.75 41.27,73.03 41.27,87 42.55,88.27 55.88,88.27 v57.15,89.53 | v59.05,89.53 60.33,88.27 v71.12,88.27 | v79.38,88.27 88.27,88.27 88.27,85.72 89.53,84.45 IC14.13 | v100.33,84.45 101.6,83.19 104.78,83.19 v104.78,79.38
CLKIRQEN  (via drill 0.3)
  Top 0.254: IC5.3 45.09,87 46.35,88.27 64.14,88.27 65.41,89.53 IC4.19 v76.2,89.53 | v107.31,81.92 IC13.10
  Bottom 0.254: v76.2,89.53 76.2,93.34 78.74,93.34 81.28,90.81 97.16,90.81 99.69,93.34 106.68,93.34 107.31,92.71 v107.31,81.92
CTS  (via drill 0.3)
  Top 0.305: X2.8 149.12,33.12 148.59,33.66 148.59,37.47 146.69,39.37 v135.89,39.37
  Bottom 0.305: v135.89,39.37 IC15.13
DCD  (via drill 0.3)
  Top 0.305: X2.9 150.16,35.87 v149.86,35.56
  Bottom 0.305: IC16.8 146.05,19.68 148.59,22.23 148.59,26.67 147.96,27.3 147.96,29.21 148.59,29.84 148.59,34.29 v149.86,35.56
DSR
  Top 0.305: IC16.13 135.89,26.67 136.53,27.3 147.32,27.3 147.96,26.67 149.22,26.67 150.19,27.64 X2.6
DTR  (via drill 0.3)
  Top 0.305: IC16.14 133.35,26.67 134.62,27.94 v149.22,27.94
  Bottom 0.305: X2.4 150.7,34.49 149.22,33.02 v149.22,27.94
GND  (via drill 0.3, 0.6, 0.7)
  Top 0.406: v3.81,34.29 v21.59,34.29 | v3.81,36.83 13.97,36.83 14.61,36.2 U$3.10 | v15.24,68.58 18.41,68.58 19.05,69.22 v29.21,69.22 | 77.15,23.81 v78.11,22.86
  Top 0.61: IC5.10 48.26,69.22 49.53,67.94 56.52,67.94 57.78,69.22 IC4.10 63.5,69.22 65.41,67.31 v69.85,67.31 | C9.2 v71.12,22.86 76.2,22.86 77.15,23.81 77.47,24.13 87.63,24.13 v88.9,22.86 v93.34,22.86 IC9.19 | v21.59,28.57 C10.2 | v21.59,34.29 v38.73,34.29 49.53,34.29 51.44,32.38 v55.24,32.38 | C7.2 21.59,62.87 22.86,61.59 v26.67,61.59 | IC9.19 IC9.20 | IC9.19 IC9.22 C14.2 130.81,22.86 | 130.81,22.86 IC16.15 | 130.81,22.86 143.51,22.86 | 143.51,22.86 IC16.10 | C15.2 v130.81,39.37 | v144.78,33.02 v147.32,33.02 | IC15.15 130.81,44.45 132.72,46.35 135.25,46.35 135.89,46.99 C3.+ | IC14.8 87.63,74.3 88.9,72.39 v97.79,72.39 | IC3.8 154.94,62.23 143.51,62.23 142.24,63.5 133.35,63.5 C16.2 | v64.14,34.29 65.41,34.29 66.67,35.56 v71.12,35.56 | 143.51,22.86 144.78,21.59 144.78,13.34 145.41,12.7 145.41,10.16
  Top 0.813: IC6.16 77.47,64.77 78.74,63.5 89.53,63.5 90.81,64.77 IC7.16
  Top 1.016: IC5.10 v38.73,69.22 v29.21,69.22 | C26.2 128.27,63.5 129.54,64.77 C16.2 | IC11.7 137.79,74.93 v133.99,74.93 122.56,74.93 121.28,76.2 IC12.7 119.38,74.93 104.14,74.93 102.87,76.2 IC13.7 v97.79,76.83
  Top 1.27: U$1.C1 18.41,10.16 19.68,8.89 19.68,8.26 21.59,6.35 IC2.8 | v145.41,3.81 v145.62,10.36
  Bottom 0.254: U$3.3 15.24,53.98 14.61,54.61 8.89,54.61 8.26,55.24 8.26,56.52 8.89,57.15 13.97,57.15 14.61,57.78 20.95,57.78 21.59,58.42 C7.2 | JP4.3 33.66,51.44 34.29,50.8 38.73,50.8 | 38.73,41.27 JP5.3 | 39.37,2.54 JP11.3 | C22.2 31.11,87.63 30.48,87 IC1.3 IC1.4 | IC4.3 60.33,87 58.42,87.63 58.42,93.98 61.59,95.89 C12.2
  Bottom 0.406: 1.91,36.83 v3.81,36.83 | 1.91,34.29 v3.81,34.29 | IC4.10 62.23,69.22 63.5,70.48 63.5,73.03 62.23,74.3 IC4.8 | 1.91,69.85 13.97,69.85 v15.24,68.58 | C11.2 80.01,17.78 79.38,18.41 79.38,21.59 v78.11,22.86
  Bottom 0.61: 69.85,64.77 IC6.16 | v71.12,22.86 v71.12,35.56 71.12,60.33 69.85,61.59 69.85,64.77 | U$3.10 19.68,36.2 v21.59,34.29 v21.59,28.57 20.32,27.3 20.32,23.5 19.68,22.86 JP10.3 | v26.67,61.59 29.21,64.14 v29.21,69.22 | 62.23,2.54 C23.2 63.5,10.16 63.5,24.13 64.14,24.77 65.41,24.77 C9.2 | 86.36,2.54 C17.2 87,8.89 87.63,9.53 87.63,15.88 88.9,17.14 v88.9,22.86 | v93.34,22.86 C25.2 | 130.18,2.54 QG1.7 | IC9.22 120.02,22.86 118.75,24.13 118.75,29.84 119.38,30.48 IC9.25 122.56,30.48 124.46,32.38 C15.2 | v130.81,39.37 IC15.15 | IC16.10 143.51,29.84 144.78,31.11 v144.78,33.02 | v147.32,33.02 147.32,35.56 149.22,37.47 150.9,37.47 X2.5 | IC8.7 105.41,7.62 107.95,10.16 C27.2 | 69.85,64.77 v69.85,67.31 71.12,68.58 71.12,73.66 | IC9.14 104.14,35.56 103.5,34.92 103.5,23.5 104.14,22.86 IC9.19 | 142.24,97.79 C19.2 | 123.83,97.79 C18.2 | 105.41,97.79 C20.2 | 86.36,97.79 C21.2 | 64.14,97.79 C12.2 | 46.99,97.79 C13.2 | 31.11,97.79 C22.2 | IC4.13 70.48,74.3 71.12,73.66 | 71.12,73.66 72.39,73.66 73.03,74.3 73.03,76.83 72.39,77.47 72.39,80.01 73.66,81.28 73.66,97.79 | 139.06,76.83 IC11.7 | v55.24,32.38 55.88,32.38 56.52,33.02 62.87,33.02 v64.14,34.29 | 53.34,2.54 C24.2
  Bottom 1.016: v38.73,34.29 38.73,41.27 38.73,50.8 v38.73,69.22 | 153.03,10.36 152.4,11 | C3.+ 135.89,57.78 132.08,61.59 C16.2 132.72,64.77 133.99,66.04 v133.99,74.93 | IC7.16 v97.79,72.39 v97.79,76.83 | v29.21,69.22 29.21,71.12 28.57,71.75 IC1.8 26.67,74.3 26.04,74.93 26.04,97.79 | 139.06,76.83 137.16,78.11 137.16,97.79
  Bottom 1.27: C8.- 8.26,4.45 8.26,6.35 10.16,8.26 U$1.C1 U$1.A1 3.81,10.16 1.91,12.06 1.91,34.29 1.91,36.83 1.91,69.85 1.91,77.47 3.17,78.74 U$1.A28 U$1.A29 U$1.A30 U$1.A31 U$1.A32 U$1.C32 10.16,95.89 12.06,97.79 26.04,97.79 31.11,97.79 46.99,97.79 64.14,97.79 73.66,97.79 86.36,97.79 105.41,97.79 123.83,97.79 137.16,97.79 142.24,97.79 | IC2.8 22.86,3.81 24.13,2.54 39.37,2.54 53.34,2.54 62.23,2.54 81.28,2.54 | 81.28,2.54 86.36,2.54 105.41,2.54 | 105.41,2.54 130.18,2.54 144.15,2.54 v145.41,3.81 | 81.28,2.54 IC10.7 | 105.41,2.54 IC8.7 | v145.62,10.36 153.03,10.36 U$2.3 | 152.4,11 X2.G1
  pour Bottom (isolate 1.016): 1.27,98.42 158.12,98.42 158.12,1.91 1.27,1.91
IOINH  (via drill 0.3)
  Top 0.254: IC11.11 144.15,84.45 142.88,85.72 127.64,85.72 125.09,83.19 97.16,83.19 94.61,80.64 78.74,80.64 77.47,79.38 IC4.15 | IC5.7 v48.9,76.83
  Bottom 0.254: v48.9,76.83 50.16,78.11 62.87,78.11 64.77,80.01 67.31,80.01 67.94,79.38 IC4.15
LCTS  (via drill 0.3)
  Top 0.254: IC9.36 v133.35,58.42 | v134.62,45.09 137.16,45.09 138.43,43.81 IC15.12
  Bottom 0.254: v133.35,58.42 133.35,46.35 v134.62,45.09
LDCD  (via drill 0.3)
  Top 0.305: v144.78,29.21 143.51,29.21 142.88,28.57 125.73,28.57 122.56,31.75 v118.75,31.75 | v118.75,63.5 IC9.38
  Bottom 0.305: IC16.9 146.05,27.3 v144.78,29.21 | v118.75,31.75 v118.75,63.5
LDSR  (via drill 0.3)
  Top 0.254: v122.56,38.1 v137.16,38.1
  Bottom 0.254: IC16.12 138.43,26.04 137.16,27.3 v137.16,38.1 | v122.56,38.1 122.56,60.96 IC9.37
LDTR  (via drill 0.3)
  Top 0.254: IC9.33 125.73,50.8 126.36,51.44 v137.16,51.44
  Bottom 0.254: v137.16,51.44 137.16,40.64 139.7,38.1 139.7,31.11 140.97,29.84 IC16.11
LED  (via drill 0.3)
  Top 0.254: v114.3,81.92 IC12.5 | v114.3,78.11 97.16,78.11 94.61,75.56 v71.75,75.56 | IC5.5 v48.9,81.92 | IC4.5 v66.67,81.92
  Bottom 0.254: v114.3,78.11 v114.3,81.92 | v48.9,81.92 50.16,83.19 54.61,83.19 57.15,80.64 59.69,80.64 60.96,81.92 IC4.5 | v66.67,81.92 67.94,80.64 71.75,80.64 v71.75,75.56
LRTS  (via drill 0.3)
  Top 0.254: IC9.32 124.46,48.26 127,50.8 v140.97,50.8
  Bottom 0.254: v140.97,50.8 IC15.11
LRX  (via drill 0.3)
  Top 0.254: IC9.10 116.84,45.72 118.11,46.99 124.46,46.99 127.64,50.16 v146.05,50.16
  Bottom 0.254: v146.05,50.16 IC15.9
LTX  (via drill 0.3)
  Top 0.254: IC9.11 116.84,43.18 118.11,44.45 123.19,44.45 128.27,49.53 v143.51,49.53
  Bottom 0.254: v143.51,49.53 IC15.10
N$1
  Bottom 0.254: IC13.2 100.33,89.53 99.69,88.9 99.69,85.72 99.06,85.09 99.06,83.19 99.69,82.55 99.69,22.86 93.98,17.14 93.98,9.53 95.25,8.26 IC8.3
N$2  (via drill 0.3)
  Top 0.254: v61.59,29.21 65.41,29.21 67.94,31.75 IC6.3
  Bottom 0.254: JP8.2 52.7,11.43 53.98,12.7 53.98,16.51 54.61,17.14 54.61,28.57 56.52,30.48 60.33,30.48 v61.59,29.21
N$3
  Bottom 0.254: IC9.15 107.31,33.02 107.31,48.26 IC9.9
N$4  (via drill 0.3)
  Top 0.406: JP1.2 59.05,11.43 v59.69,10.79
  Bottom 0.406: v59.69,10.79 59.69,12.06 60.33,12.7 60.33,26.67 62.87,29.21 62.87,29.84 60.96,31.75 IC6.30
N$5
  Bottom 0.254: JP2.2 IC6.1
N$6
  Bottom 0.254: U$3.19 28.57,56.52 29.21,57.15 29.21,58.42 30.48,59.69 30.48,81.92 IC1.5
N$9
  Bottom 0.406: IC7.30 83.82,31.75 85.09,30.48 85.09,24.77 83.82,23.5 JP9.2
N$10  (via drill 0.3)
  Top 0.254: JP18.2 43.18,17.14 39.37,17.14 JP17.5 v34.92,18.41 | IC2.6 v27.94,11.43
  Bottom 0.254: v27.94,11.43 29.21,12.7 34.92,12.7 v34.92,18.41
N$11  (via drill 0.3)
  Top 0.254: v93.98,74.93 100.97,74.93 v101.6,74.3
  Bottom 0.254: IC14.7 87.63,76.83 88.9,75.56 93.34,75.56 v93.98,74.93 | v101.6,74.3 103.5,74.3 105.41,76.2 105.41,83.82 104.78,84.45 IC13.4
N$12
  Top 0.254: IC2.10 JP13.2
  Bottom 0.254: JP13.2 38.73,8.89 40.01,10.16 43.18,10.16 JP14.5
N$13  (via drill 0.3)
  Top 0.254: IC10.12 71.12,12.06 71.75,11.43 83.19,11.43 87,15.24 v111.76,15.24 | v111.76,71.75 v135.89,71.75 | v135.89,79.38 IC11.6
  Bottom 0.254: v111.76,15.24 v111.76,71.75 | v135.89,71.75 v135.89,79.38
N$14  (via drill 0.3)
  Top 0.254: JP3.3 53.34,17.78 53.98,17.14 60.33,17.14 61.59,18.41 v67.31,18.41 | v67.31,8.89 v78.74,8.89
  Bottom 0.254: v67.31,18.41 v67.31,8.89 | v78.74,8.89 IC10.6
N$15  (via drill 0.3)
  Top 0.254: v48.9,21.59 58.42,21.59 JP3.1 59.05,19.05 60.96,20.95 v72.39,20.95
  Bottom 0.254: JP20.2 38.1,29.21 38.73,29.84 41.27,29.84 41.91,29.21 41.91,28.57 42.55,27.94 JP15.2 46.35,29.84 48.26,29.84 48.9,29.21 v48.9,21.59 | v72.39,20.95 72.39,17.78 73.66,16.51 IC10.11
N$16  (via drill 0.3)
  Top 0.254: IC2.1 26.67,24.13 27.94,22.86 32.38,22.86 33.02,22.23 v55.88,22.23
  Bottom 0.254: v55.88,22.23 JP3.2
N$19  (via drill 0.3)
  Top 0.254: IC5.4 45.09,84.45 46.35,85.72 v57.78,85.72
  Bottom 0.254: v57.78,85.72 71.75,85.72 72.39,85.09 72.39,83.19 71.12,81.92 IC4.16
N$20
  Top 0.254: JP10.2 18.41,25.4 22.23,21.59 IC2.2
N$21
  Bottom 0.254: IC2.14 28.57,19.05 27.94,18.41 27.94,15.88 26.67,14.61 26.67,8.89 27.94,7.62 34.92,7.62 35.56,6.99 40.01,6.99 JP11.2
N$22  (via drill 0.3)
  Top 0.254: JP12.1 19.68,18.41 21.59,16.51 IC2.4 | JP18.6 43.18,23.5 41.91,24.77 40.01,24.77 38.73,23.5 JP17.1 v33.02,23.5
  Bottom 0.254: IC2.4 24.77,16.51 25.4,17.14 25.4,22.23 26.04,22.86 32.38,22.86 v33.02,23.5
N$23  (via drill 0.3)
  Top 0.254: v83.19,6.35 86.36,6.35 87,5.71 IC8.1
  Bottom 0.254: IC10.8 81.28,10.16 83.19,8.26 v83.19,6.35
N$24
  Bottom 0.254: U$3.18 JP4.2
N$26  (via drill 0.3)
  Top 0.254: v97.16,89.53 IC14.15 | v97.16,79.38 IC13.6
  Bottom 0.254: v97.16,79.38 v97.16,89.53
N$27  (via drill 0.3)
  Top 0.254: JP18.4 43.18,19.68 40.01,19.68 38.73,20.95 JP17.3 v34.29,20.95 | IC2.5 v27.94,13.97
  Bottom 0.254: JP12.3 22.23,13.34 IC2.5 | v27.94,13.97 29.21,15.24 34.29,15.24 v34.29,20.95
N$28  (via drill 0.3)
  Top 0.254: v26.04,21.59 IC2.15
  Bottom 0.254: JP12.2 19.68,15.88 20.32,15.24 24.77,15.24 26.04,16.51 v26.04,21.59
N$29  (via drill 0.3)
  Top 0.254: IC13.8 v116.2,76.83 | v116.2,87 IC12.3
  Bottom 0.254: v116.2,76.83 v116.2,87
N$30
  Top 0.254: IC2.11 JP13.4 | JP14.3 45.72,10.16 59.05,10.16 62.23,6.99 64.14,6.99 65.41,5.71 IC10.1
  Bottom 0.254: JP13.4 40.01,12.7 43.18,12.7 JP14.3
N$31  (via drill 0.3)
  Top 0.254: IC12.6 123.19,79.38 124.46,78.11 131.44,78.11 132.72,76.83 v136.53,76.83
  Bottom 0.254: v136.53,76.83 136.53,73.66 138.43,71.75 138.43,55.88 139.7,54.61 R2.2
N$32
  Bottom 0.406: R2.1 152.4,53.98 154.31,52.07 LED1.K
N$33  (via drill 0.3)
  Top 0.254: IC13.12 114.3,87 115.57,85.72 v125.09,85.72 | v125.09,79.38 IC12.9 132.72,79.38 133.99,78.11 v149.86,78.11
  Bottom 0.254: v125.09,85.72 v125.09,79.38 | v149.86,78.11 JP7.2
N$34  (via drill 0.3)
  Top 0.254: IC7.29 90.17,34.29 91.44,35.56 v100.97,35.56
  Bottom 0.254: v100.97,35.56 100.97,20.32 97.79,17.14 IC8.11
N$35
  Top 0.254: IC12.11 132.72,84.45 133.99,83.19 142.88,83.19 144.15,81.92 IC11.10
N$36
  Top 0.254: IC2.12 JP13.6 | JP14.1 45.72,15.24 78.11,15.24 78.74,14.61 IC10.9
  Bottom 0.254: JP13.6 40.01,15.24 43.18,15.24 JP14.1
N$37  (via drill 0.3)
  Top 0.254: v104.14,16.51 v110.49,16.51 | v111.12,63.5 v114.3,63.5
  Bottom 0.254: IC8.6 102.87,6.99 104.14,8.26 v104.14,16.51 | IC13.13 113.03,89.53 113.03,73.66 114.3,72.39 v114.3,63.5 | v110.49,16.51 110.49,48.26 111.12,48.9 v111.12,63.5
N$39  (via drill 0.3)
  Top 0.406: QG1.8 128.27,12.7 127.64,12.06 116.84,12.06 v114.3,15.88 | v114.3,30.48 IC9.16
  Bottom 0.406: v114.3,15.88 v114.3,30.48
N$40
  Top 0.254: IC12.13 133.35,89.53 134.62,88.27 142.24,88.27 143.51,87 IC11.12
N$41
  Bottom 0.61: IC15.3 133.35,33.66 132.08,32.38 C1.-
N$42
  Bottom 0.61: IC15.1 128.27,33.66 129.54,32.38 C1.+
N$43
  Top 0.61: IC16.3 133.35,15.88 137.16,12.06 137.16,8.26 138.43,6.99 140.97,6.99 C6.-
N$44
  Top 0.61: IC16.1 128.27,16.51 129.54,15.24 132.08,15.24 135.89,11.43 135.89,7.62 137.79,5.71 C6.+
N$45
  Bottom 0.61: C2.- IC15.5
N$46
  Bottom 0.61: C2.+ IC15.4
N$47
  Top 0.61: IC16.5 138.43,15.24 139.06,14.61 140.34,14.61 C5.-
N$48
  Top 0.61: IC16.4 135.89,15.24 138.43,12.7 C5.+
N$49
  Bottom 0.61: IC16.6 140.97,18.41 142.24,19.68 142.24,31.11 140.97,32.38 IC15.6 140.97,38.73 139.7,40.01 139.7,46.99 C3.-
N$50
  Bottom 0.61: C4.+ 129.54,38.73 130.81,37.47 IC15.2 130.81,29.21 129.54,27.94 129.54,21.59 130.81,20.32 IC16.2
N$53  (via drill 0.3)
  Top 0.254: IC5.8 45.72,74.3 46.99,73.03 53.98,73.03 55.24,71.75 v59.05,71.75 | v69.22,21.59 78.74,21.59 80.64,23.5 87,23.5 90.81,19.68 99.06,19.68 100.33,18.41 106.68,18.41 108.58,20.95 v116.2,20.95
  Bottom 0.254: R1.1 122.56,17.14 120.02,17.14 v116.2,20.95 | v59.05,71.75 59.05,67.31 60.33,66.04 60.33,39.37 66.04,33.66 66.04,27.94 69.22,24.77 v69.22,21.59
  Bottom 0.305: R1.1 127.64,15.88 128.27,15.24 133.99,15.24 139.7,9.53 144.78,9.53 146.69,7.62 146.69,5.71 147.32,5.08 153.47,5.08 U$2.1
N$54  (via drill 0.3)
  Top 0.254: IC10.3 71.12,6.99 71.75,7.62 97.16,7.62 97.79,6.99 IC8.4 | v102.23,70.48 v140.97,70.48
  Bottom 0.254: IC8.4 97.79,10.16 99.06,11.43 99.06,17.14 102.23,20.32 v102.23,70.48 | IC3.4 144.78,62.23 140.97,66.04 v140.97,70.48
N$71
  Top 0.254: U$3.9 17.14,38.73 16.51,39.37 16.51,43.18 17.14,43.81 U$3.7
  Bottom 0.254: JP5.2 U$3.14 U$3.7
N$74
  Bottom 0.254: IC3.12 JP7.1
N$75
  Bottom 0.254: IC3.10 JP7.3
PHI2  (via drill 0.3)
  Top 0.254: v100.33,40.64 IC9.12 | U$1.C26 v17.14,73.66 | v17.14,79.38 IC1.6 32.38,79.38 33.66,78.11 v73.66,78.11 | v73.66,69.22 v100.33,69.22 | IC8.12 95.25,12.06 95.89,11.43 99.06,11.43 100.33,12.7 IC8.10
  Bottom 0.254: IC8.12 95.25,16.51 100.33,21.59 v100.33,40.64 v100.33,69.22 | v17.14,73.66 v17.14,79.38 | v73.66,78.11 v73.66,69.22
R/-W  (via drill 0.3, 0.8)
  Top 0.254: IC11.1 135.89,92.08 134.62,90.81 106.05,90.81 | U$1.C25 13.97,71.12 v14.61,71.75 | v16.51,91.44 25.4,91.44 26.04,92.08 IC1.1 33.02,92.08 34.29,93.34 78.11,93.34 80.64,90.81 106.05,90.81 | v106.05,90.17 106.05,90.81
  Bottom 0.254: v14.61,71.75 14.61,89.53 v16.51,91.44 | IC8.9 102.87,55.88 104.14,57.15 103.5,57.78 103.5,71.12 106.68,74.3 106.68,80.64 106.05,81.28 v106.05,90.17
RTS  (via drill 0.3)
  Top 0.305: X2.7 142.34,30.38 139.7,33.02 v134.62,33.02
  Bottom 0.305: v134.62,33.02 134.62,39.37 133.35,40.64 IC15.14
RX  (via drill 0.3)
  Top 0.305: X2.2 146.25,29.01 v146.05,29.21
  Bottom 0.305: v146.05,29.21 IC15.8
S$1
  Top 2: 20,-1 -1,-1 -1,20
S$2
  Top 2: 140,-1 161,-1 161,20
S$3
  Top 2: 20,101 -1,101 -1,80
S$4
  Top 2: 161,80 161,101 140,101
S$5
  Bottom 2: 20,-1 -1,-1 -1,20
S$6
  Bottom 2: 140,-1 161,-1 161,20
S$7
  Bottom 2: 20,101 -1,101 -1,80
S$8
  Bottom 2: 161,80 161,101 140,101
TX  (via drill 0.3)
  Top 0.305: v143.51,31.75 X2.3
  Bottom 0.305: v143.51,31.75 IC15.7
UARTINT  (via drill 0.3)
  Top 0.254: IC9.30 123.19,43.18 v127.64,47.62 | v127.64,55.24 138.43,55.24 139.7,56.52 v148.59,56.52
  Bottom 0.254: v127.64,47.62 v127.64,55.24 | v148.59,56.52 148.59,74.93 149.22,75.56 149.22,89.53 IC11.13
UARTRES  (via drill 0.3)
  Top 0.254: IC9.35 124.46,55.88 125.09,56.52 v130.81,56.52 | v134.62,84.45 IC11.4
  Bottom 0.254: v130.81,56.52 130.81,71.12 132.72,73.03 132.72,82.55 v134.62,84.45
VBUF  (via drill 0.3)
  Top 0.406: U$1.A2 6.99,12.7 8.26,13.97 13.34,13.97 13.97,14.61 19.05,14.61 20.95,12.7 59.05,12.7 61.59,10.16 81.92,10.16 82.55,10.79 v83.19,10.79 | C11.1 86.36,19.05 JP9.1
  Bottom 0.406: v83.19,10.79 83.19,12.7 86.36,15.88 JP9.1
VCC  (via drill 0.3, 0.6)
  Top 0.254: v14.61,44.45 15.24,44.45 15.88,45.09 30.48,45.09 JP5.1 | v40.01,56.52 JP4.1 | U$3.16 32.38,48.9 33.02,48.26 v40.01,48.26 | v40.01,38.73 U$3.12 | v66.04,19.05 JP2.1
  Top 0.406: IC3.16 137.16,66.04 138.43,64.77 v149.86,64.77
  Top 0.61: v58.42,22.86 C9.1 | U$3.20 32.38,59.05 33.02,58.42 v40.01,58.42 | v109.22,38.1 IC9.13 | v109.22,29.21 102.23,29.21 100.97,27.94 92.08,27.94 v90.81,26.67 IC7.32 77.47,26.67 76.2,27.94 69.85,27.94 68.58,26.67 IC6.32 53.98,26.67 50.8,29.84 v43.18,29.84 34.29,29.84 33.02,28.57 C10.1 26.67,29.84 17.14,29.84 13.97,26.67 1.91,26.67 | 144.78,97.79 C19.1 | 126.36,97.79 C18.1 | 107.95,97.79 C20.1 | 88.9,97.79 C21.1 | 66.67,97.79 C12.1 | 49.53,97.79 C13.1 | IC5.20 IC5.1 | 33.66,97.79 C22.1 | 121.28,66.04 v109.86,66.04 | 55.88,2.54 C24.1 | JP1.1 JP8.1
  Top 0.813: IC10.14 64.14,13.34 C23.1 | 60.33,2.54 v60.33,4.45 | IC8.14 87,13.34 C17.1 | 84.45,2.54 v84.45,4.45
  Top 1.016: 118.11,97.79 v118.11,95.89
  Top 1.27: 60.33,2.54 84.45,2.54 109.86,2.54 C27.1 110.49,7.62 113.03,5.08 QG1.1 | 11.43,5.71 9.53,7.62 5.08,7.62 1.91,10.79 1.91,26.67 1.91,89.53 3.17,90.81 7.62,90.81 7.62,97.79 33.66,97.79 49.53,97.79 66.67,97.79 88.9,97.79 107.95,97.79 118.11,97.79 126.36,97.79 144.78,97.79 | v126.36,19.05 124.46,19.05 123.83,18.41 118.11,18.41 117.47,19.05 v116.2,19.05 v109.22,19.05 | C14.1 IC16.16 | C15.1 125.09,42.55 125.73,42.55 126.36,43.18 IC15.16 128.27,44.45 130.18,46.35 130.81,46.35 132.08,47.62 C4.- | IC9.39 121.28,66.04 C26.1 v127.64,66.04 128.91,67.31 C16.1 IC3.16
  Top 1.778: JP21.3 55.88,2.54 60.33,2.54 | 11.43,5.71 C8.+
  Bottom 0.254: U$3.16 U$3.5 15.24,48.9 14.61,49.53 8.89,49.53 8.26,48.9 8.26,45.09 8.89,44.45 v14.61,44.45 | 41.27,48.26 v40.01,48.26 | 41.27,38.73 v40.01,38.73 | 64.77,19.05 v66.04,19.05
  Bottom 0.406: v149.86,64.77 IC3.6 149.86,58.42 151.76,56.52 154.94,56.52 LED1.A
  Bottom 0.61: 41.27,56.52 41.27,48.26 41.27,38.73 41.27,33.02 43.18,31.11 v43.18,29.84 | 41.27,56.52 41.27,57.78 | v58.42,22.86 IC6.32 IC6.31 | 41.27,56.52 v40.01,56.52 | v40.01,58.42 40.64,58.42 41.27,57.78 | C7.1 24.13,61.59 U$3.20 | C10.1 28.57,28.57 30.48,26.67 IC2.16 | C9.1 64.77,19.05 64.77,14.61 IC10.14 | IC8.14 90.17,15.88 90.81,16.51 C25.1 v90.81,26.67 | 125.09,41.91 C15.1 | 125.09,25.4 C14.1 | v109.22,19.05 v109.22,29.21 v109.22,38.1 109.22,48.9 109.86,49.53 v109.86,66.04 | IC11.14 147.32,92.71 144.78,95.25 C19.1 | IC12.14 128.91,93.34 C18.1 | IC13.14 110.49,93.34 C20.1 | IC14.16 91.44,93.34 C21.1 | IC4.20 69.22,93.34 C12.1 | IC5.20 51.44,93.98 C13.1 | C22.1 36.2,93.34 IC1.16 39.37,92.08 40.01,91.44 40.01,73.03 41.27,71.75 41.27,57.78 | C24.1 JP1.1
  Bottom 0.813: C23.1 61.59,11.43 60.33,9.53 v60.33,4.45 | C17.1 85.72,11.43 84.45,10.16 v84.45,4.45
  Bottom 1.016: IC9.40 120.65,73.03 118.11,75.56 v118.11,95.89
  Bottom 1.27: 12.7,11.43 11.43,12.7 U$1.C2 U$1.C3 12.06,15.24 12.7,14.61 | QG1.1 QG1.14 114.94,14.61 R1.2 v116.2,19.05 | 125.09,41.91 126.36,40.64 126.36,27.3 C14.1 | 125.09,25.4 126.36,24.13 v126.36,19.05 | IC9.40 IC9.39 | v127.64,66.04 127.64,57.78 132.08,53.34 C4.-
  Bottom 1.778: JP21.3 13.97,2.54 12.7,3.81 C8.+ 11.43,5.08 12.7,6.35 12.7,11.43 12.7,14.61
  pour Top (isolate 1.016): 1.27,91.44 26.67,91.44 26.67,98.42 158.12,98.42 158.12,1.91 1.27,1.91
W/-R  (via drill 0.3)
  Top 0.254: v135.25,89.53 IC11.2 | v94.61,73.66 v131.44,73.66
  Bottom 0.254: IC8.13 92.71,17.78 95.25,20.32 95.25,49.53 94.61,50.16 v94.61,73.66 | v135.25,89.53 131.44,85.72 v131.44,73.66

## Text on the board
Top: CSA BIOS V3.0G | (C) A. Fachat
tNames: CSA BIOS V3.0G | (C) A. Fachat